# EAGLE schematic pc_ads1292r_shield_v3.1 (EAGLE 6.6.0)
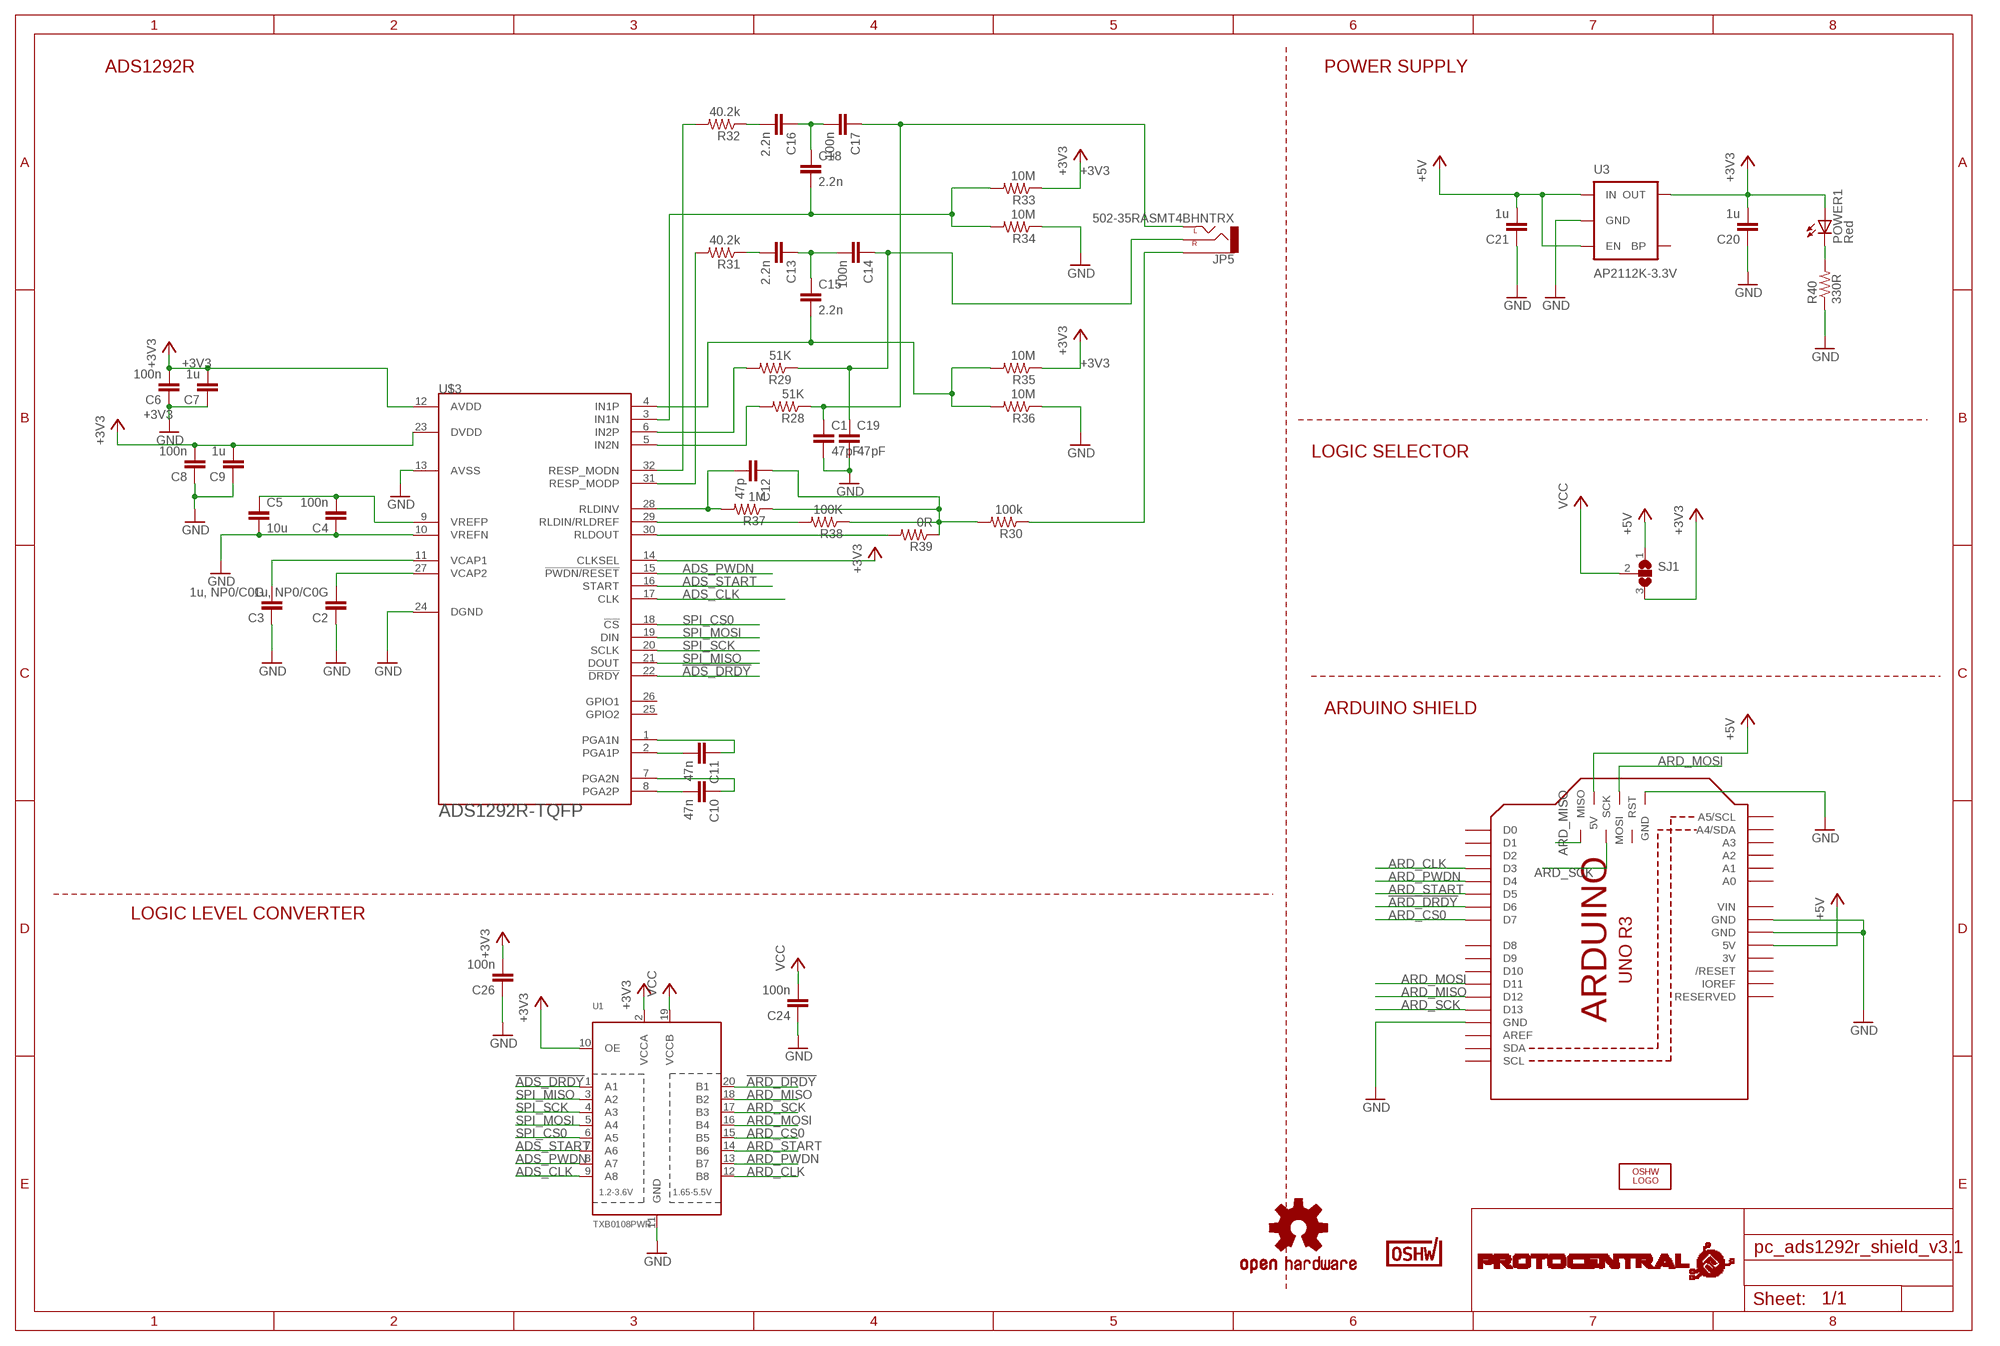
[diagram p0: schematic, sheet 1]

## Parts
C1  47pF  C-EUC0402  [C0402]
C2  1u, NP0/C0G  C-EUC0402  [C0402]
C3  1u, NP0/C0G  C-EUC0402  [C0402]
C4  100n  C-EUC0402  [C0402]
C5  10u  C-EUC0603  [C0603]
C6  100n  C-EUC0402  [C0402]
C7  1u  C-EUC0402  [C0402]
C8  100n  C-EUC0402  [C0402]
C9  1u  C-EUC0402  [C0402]
C10  47n  C-EUC0402  [C0402]
C11  47n  C-EUC0402  [C0402]
C12  47p  C-EUC0402  [C0402]
C13  2.2n  C-EUC0402  [C0402]
C14  100n  C-EUC0402  [C0402]
C15  2.2n  C-EUC0402  [C0402]
C16  2.2n  C-EUC0402  [C0402]
C17  100n  C-EUC0402  [C0402]
C18  2.2n  C-EUC0402  [C0402]
C19  47pF  C-EUC0402  [C0402]
C20  1u  C-EUC0402  [C0402]
C21  1u  C-EUC0402  [C0402]
C24  100n  C-EUC0402  [C0402]
C26  100n  C-EUC0402  [C0402]
JP5  502-35RASMT4BHNTRX  AUDIO-JACKSMD2  [AUDIO-JACK-3.5MM-SMD]
LOGO1  OSHW_LOGO_FILLX0100-NT  [OSHW_FILLX100_NOTEXT]
M1  ARDUINO  [ARDUINO]
POWER1  Red  LEDCHIPLED_0603  [CHIPLED_0603]
R28  51K  R-US_R0402  [R0402]
R29  51K  R-US_R0402  [R0402]
R30  100k  R-US_R0402  [R0402]
R31  40.2k  R-US_R0402  [R0402]
R32  40.2k  R-US_R0402  [R0402]
R33  10M  R-US_R0402  [R0402]
R34  10M  R-US_R0402  [R0402]
R35  10M  R-US_R0402  [R0402]
R36  10M  R-US_R0402  [R0402]
R37  1M  R-US_R0402  [R0402]
R38  100K  R-US_R0402  [R0402]
R39  0R  R-US_R0402  [R0402]
R40  330R  R-US_R0402  [R0402]
SJ1  SJ2W  [SJ_2]
U1  TXB0108PWR  [TSSOP20]
U3  AP2112K-3.3V  V_REG_LDOSMD  [SOT23-5]
U$1  CERT-SMALL  [CERT-SMALL-SILK]
U$3  ADS1292R-TQFP  [SQFP-S-5X5-32]
U$4  PROTY_LOGO_WITH_TEXT  [PROTY_WITH_TEXT]
U$6  OSHW-LOGOS  [OSHW-LOGO-S]

## Nets
!ADS_DRDY: U1.1(A1) U$3.22(!DRDY)
!ARD_DRDY: M1.D6 U1.20(B1)
+3V3: C6.2 C7.2 C8.2 C9.2 C20.2 C26.2 POWER1.A R33.1 R35.1 SJ1.3 U1.2(VCCA) U1.10(OE) U3.5(OUT) U$3.12(AVDD) U$3.14(CLKSEL) U$3.23(DVDD)
+5V: C21.2 M1.5V M1.5V_ICSP(5V) SJ1.1 U3.1(IN) U3.3(EN)
ADS_CLK: U1.9(A8) U$3.17(CLK)
ADS_PWDN: U1.8(A7) U$3.15(!PWDN/RESET)
ADS_START: U1.7(A6) U$3.16(START)
ARD_CLK: M1.D3 U1.12(B8)
ARD_CS0: M1.D7 U1.15(B5)
ARD_MISO: M1.D12 M1.MISO U1.18(B2)
ARD_MOSI: M1.D11 M1.MOSI U1.16(B4)
ARD_PWDN: M1.D4 U1.13(B7)
ARD_SCK: M1.D13 M1.SCK U1.17(B3)
ARD_START: M1.D5 U1.14(B6)
GND: C1.2 C2.1 C3.1 C4.1 C5.2 C6.1 C7.1 C8.1 C9.1 C19.2 C20.1 C21.1 C24.1 C26.1 M1.GND M1.GND@1(GND) M1.GND@2(GND) M1.GND@3(GND) R34.1 R36.1 R40.1 U1.11(GND) U3.2(GND) U$3.10(VREFN) U$3.13(AVSS) U$3.24(DGND)
N$102: C2.2 U$3.27(VCAP2)
N$105: C3.2 U$3.11(VCAP1)
N$106: C4.2 C5.1 U$3.9(VREFP)
N$108: C10.2 U$3.8(PGA2P)
N$109: C10.1 U$3.7(PGA2N)
N$110: C11.2 U$3.2(PGA1P)
N$111: C11.1 U$3.1(PGA1N)
N$112: C14.1 C19.1 JP5.RING(RIGHT) R29.1
N$113: R39.2 U$3.30(RLDOUT)
N$114: JP5.SLEEVE R30.1
N$115: R31.2 U$3.31(RESP_MODP)
N$116: C13.2 R31.1
N$117: C13.1 C14.2 C15.1
N$118: R32.2 U$3.32(RESP_MODN)
N$119: C16.2 R32.1
N$120: C16.1 C17.2 C18.1
N$121: C1.1 C17.1 JP5.TIP(LEFT) R28.1
N$122: C18.2 R33.2 R34.2 U$3.3(IN1N)
N$123: C15.2 R35.2 R36.2 U$3.4(IN1P)
N$124: R29.2 U$3.6(IN2P)
N$125: R28.2 U$3.5(IN2N)
N$126: C12.2 R37.2 U$3.28(RLDINV)
N$127: R38.2 U$3.29(RLDIN/RLDREF)
N$128: C12.1 R30.2 R37.1 R38.1 R39.1
N$131: POWER1.C R40.2
SPI_CS0: U1.6(A5) U$3.18(!CS)
SPI_MISO: U1.3(A2) U$3.21(DOUT)
SPI_MOSI: U1.5(A4) U$3.19(DIN)
SPI_SCK: U1.4(A3) U$3.20(SCLK)
VCC: C24.2 SJ1.2 U1.19(VCCB)
Unconnected: M1.A0 M1.A1 M1.A2 M1.A3 M1.A4(A4/SDA) M1.A5(A5/SCL) M1.AREF M1.D0 M1.D1 M1.D2 M1.D8 M1.D9 M1.D10 M1.IOREF M1.RESERVED M1.RESET(/RESET) M1.RESET_ICSP(RST) M1.SCL M1.SDA U3.4(BP) U$3.25(GPIO2) U$3.26(GPIO1)

## Notes on the sheet
- ADS1292R | POWER SUPPLY
- LOGIC SELECTOR
- ARDUINO SHIELD
- LOGIC LEVEL CONVERTER

## Power pins joined to a net without a drawn wire
3V: M1.3V
VIN: M1.VIN

## Library data of the parts
C1-C4 C6-C21 C24 C26 = rcl:C-EU: CAPACITOR, European symbol
C5 = resistor:C-EU: CAPACITOR, European symbol
JP5 = SparkFun-Connectors:AUDIO-JACK: 3.5mm Audio Jack Simple 3.5mm common PCB mount audio jack. SKU: PRT-08032; PROD_ID: CONN-10353
LOGO1 = ohw-logo:OSHW_LOGO_FILL
M1 = circuitects:ARDUINO
POWER1 = led:LED: LED OSRAM: - CHIPLED LG R971, LG N971, LY N971, LG Q971, LY Q971, LO R971, LY R971 LH N974, LH R974 LS Q976, LO Q976, LY Q976 LO Q996 - Hyper CHIPLED LW Q18S LB Q993, LB Q99A, LB R99A - SideLED LS A670, LO A670, LY A670, LG A670, LP A670 LB A673, LV A673, LT A673, LW A673 LH A674 LY A675 LS A676, LA A676, LO A676, LY A676, LW A676 LS A679, LY A679, LG A679 - Hyper Micro SIDELED® LS Y876, LA Y876, LO Y876, LY Y876 LT Y87S - SmartLED LW L88C, LW L88S LB L89C, LB L89S, LG L890 LS L89K, LO L89K, LY L89K LS L896, LA L896, LO L896, LY L896 - TOPLED LS T670, LO T670, LY T670, LG T670, LP T670 LSG T670, LSP T670, LSY T670, LOP T670, LYG T670 LG T671, LOG T671, LSG T671 LB T673, LV T673, LT T673, LW T673 LH T674 LS T676, LA T676, LO T676, LY T676, LB T676, LH T676, LSB T676, LW T676 LB T67C, LV T67C, LT T67C, LS T67K, LO T67K, LY T67K, LW E67C LS E67B, LA E67B, LO E67B, LY E67B, LB E67C, LV E67C, LT E67C LW T67C LS T679, LY T679, LG T679 LS T770, LO T770, LY T770, LG T770, LP T770 LB T773, LV T773, LT T773, LW T773 LH T774 LS E675, LA E675, LY E675, LS T675 LS T776, LA T776, LO T776, LY T776, LB T776 LHGB T686 LT T68C, LB T68C - Hyper Mini TOPLED® LB M676 - Mini TOPLED Santana® LG M470 LS M47K, LO M47K, LY M47K Source: http://www.osram.convergy.de LUXEON: - LUMILED® LXK2-PW12-R00, LXK2-PW12-S00, LXK2-PW14-U00, LXK2-PW14-V00 LXK2-PM12-R00, LXK2-PM12-S00, LXK2-PM14-U00 LXK2-PE12-Q00, LXK2-PE12-R00, LXK2-PE12-S00, LXK2-PE14-T00, LXK2-PE14-U00 LXK2-PB12-K00, LXK2-PB12-L00, LXK2-PB12-M00, LXK2-PB14-N00, LXK2-PB14-P00, LXK2-PB14-Q00 LXK2-PR12-L00, LXK2-PR12-M00, LXK2-PR14-Q00, LXK2-PR14-R00 LXK2-PD12-Q00, LXK2-PD12-R00, LXK2-PD12-S00 LXK2-PH12-R00, LXK2-PH12-S00 LXK2-PL12-P00, LXK2-PL12-Q00, LXK2-PL12-R00 Source: www.luxeon.com KINGBRIGHT: KA-3528ASYC Source: www.kingbright.com
R28-R40 = rcl:R-US_: RESISTOR, American symbol
SJ1 = jumper:SJ2W: SMD solder JUMPER
U1 = adafruit:TXB0108PWR: 8-Bit Bi-Directional Level Shifter 1.2V-3.6V (VCCA) to 1.65V-5.5V (VCCB) bi-directional level shifter with auto direction sensing. Max data rate - VCCA 1.8V: 20Mbps (50ns), VCCA 3.3V: 100Mbps (10ns) Digikey: 296-21527-1-ND
U3 = SparkFun-PowerIC:V_REG_LDO: Voltage Regulator LDO Standard 150mA LDO voltage regulator in SOT-23 layout. Micrel part MIC5205. BP (by-pass) pin is used to lower output noise with 470pF cap.; PROD_ID: VREG-12457
U$1 = OSHWA:CERT
U$3 = circuitects:ADS1292R-TQFP
U$4 = circuitects:PROTY_LOGO_WITH_TEXT
U$6 = SparkFun:OSHW-LOGO: Open Source Hardware Logo This logo indicates the piece of hardware it is found on incorporates a OSHW license and/or adheres to the definition of open source hardware found here: http://freedomdefined.org/OSHW

## Net classes
2 gnd: width 0.102 mm, drill 0.1 mm